# EAGLE design Arduino Board (EAGLE 9.5.2)
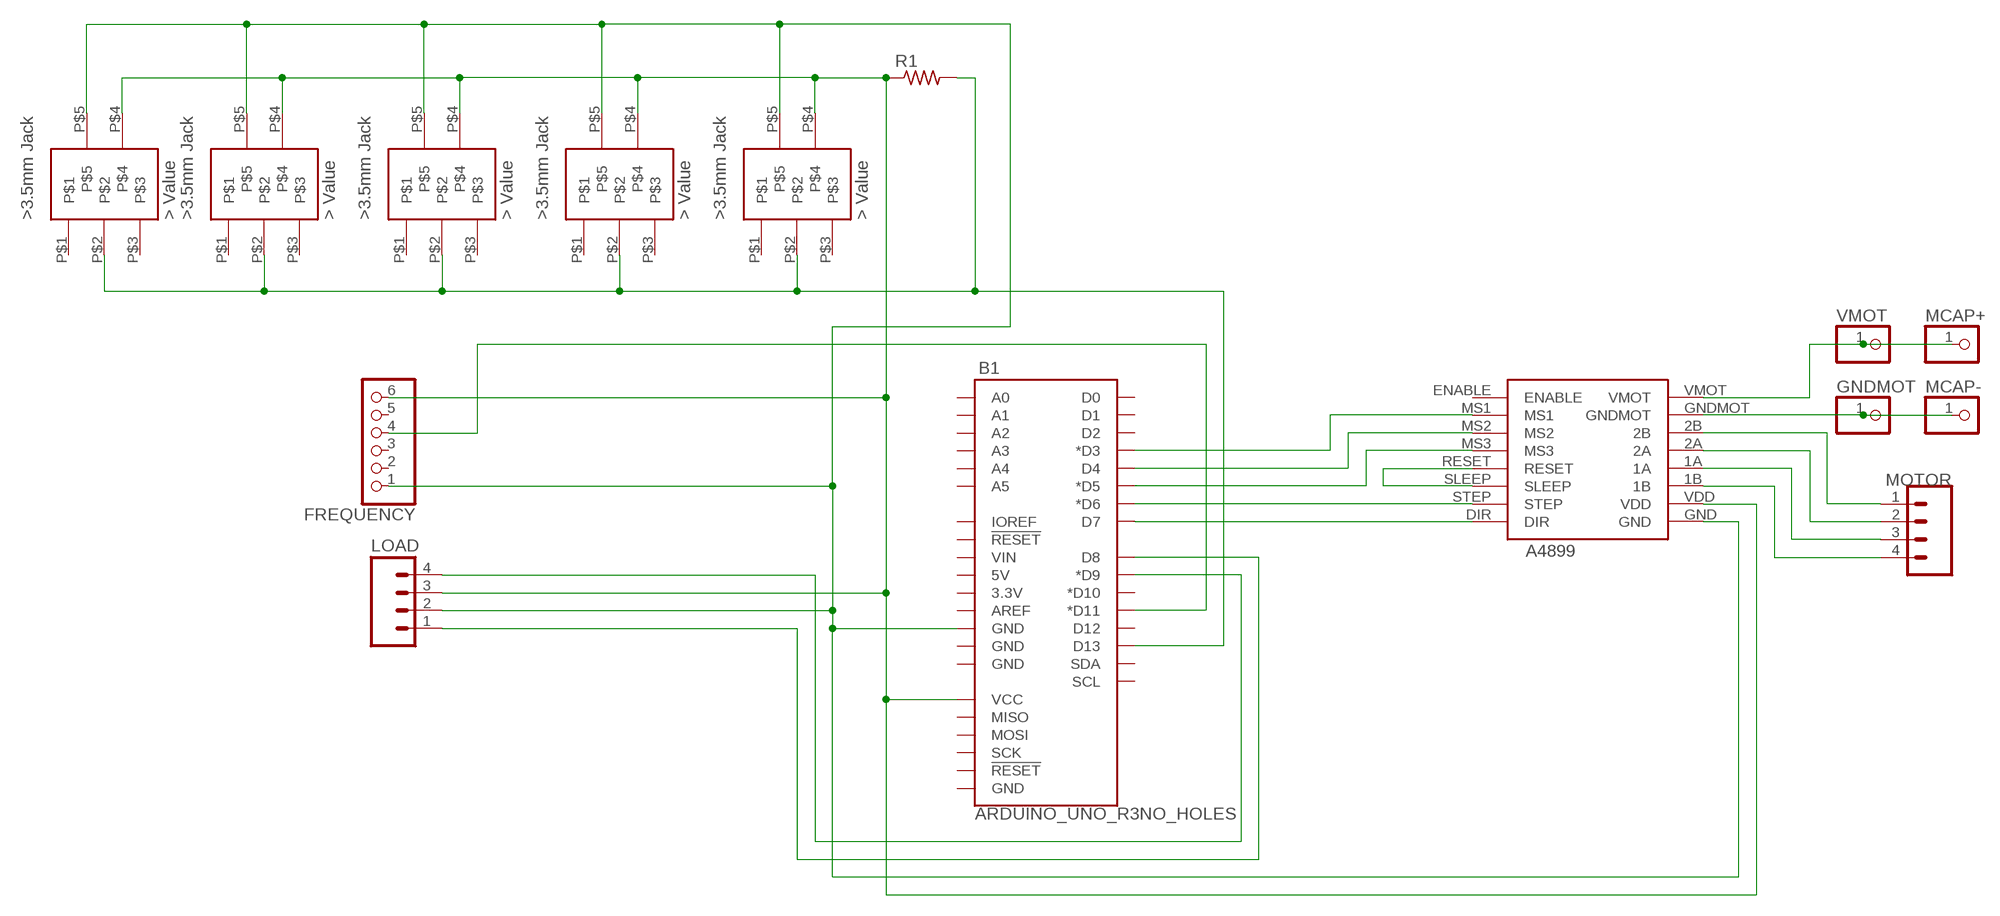
[diagram p0: schematic, sheet 1]

## Parts
3.5MM_JACK1  3.5MM_JACK  [3.5MM_JACK]
3.5MM_JACK2  3.5MM_JACK  [3.5MM_JACK]
3.5MM_JACK3  3.5MM_JACK  [3.5MM_JACK]
3.5MM_JACK4  3.5MM_JACK  [3.5MM_JACK]
3.5MM_JACK5  3.5MM_JACK  [3.5MM_JACK]
A4899_1  A4899  [A4899]
B1  ARDUINO_UNO_R3NO_HOLES  [ARDUINO_R3_NO_HOLES]
FREQUENCY  PINHD-1X6  [1X06]
GNDMOT  PINHD-1X1  [1X01]
LOAD  M04PTH  [1X04]
MCAP+  PINHD-1X1  [1X01]
MCAP-  PINHD-1X1  [1X01]
MOTOR  M04PTH  [1X04]
R1  R-US_0204/5  [0204/5]
VMOT  PINHD-1X1  [1X01]

## Nets
N$1: 3.5MM_JACK1.P$5 3.5MM_JACK2.P$5 3.5MM_JACK3.P$5 3.5MM_JACK4.P$5 3.5MM_JACK5.P$5 A4899_1.GND B1.GND@4(GND) FREQUENCY.1 LOAD.2
N$2: 3.5MM_JACK1.P$2 3.5MM_JACK2.P$2 3.5MM_JACK3.P$2 3.5MM_JACK4.P$2 3.5MM_JACK5.P$2 B1.D13 R1.2
N$3: A4899_1.1B MOTOR.4
N$4: B1.D11(*D11) FREQUENCY.4
N$5: B1.D9(*D9) LOAD.4
N$6: B1.D8 LOAD.1
N$7: A4899_1.VMOT MCAP+.1 VMOT.1
N$8: A4899_1.GNDMOT GNDMOT.1 MCAP-.1
N$9: A4899_1.2B MOTOR.1
N$10: A4899_1.2A MOTOR.2
N$11: A4899_1.1A MOTOR.3
N$12: A4899_1.MS3 B1.D5(*D5)
N$13: A4899_1.RESET A4899_1.SLEEP
N$14: 3.5MM_JACK1.P$4 3.5MM_JACK2.P$4 3.5MM_JACK3.P$4 3.5MM_JACK4.P$4 3.5MM_JACK5.P$4 A4899_1.VDD B1.VCC FREQUENCY.6 LOAD.3 R1.1
N$15: A4899_1.STEP B1.D6(*D6)
N$16: A4899_1.DIR B1.D7
N$17: A4899_1.MS2 B1.D4
N$18: A4899_1.MS1 B1.D3(*D3)
Unconnected: 3.5MM_JACK1.P$1 3.5MM_JACK1.P$3 3.5MM_JACK2.P$1 3.5MM_JACK2.P$3 3.5MM_JACK3.P$1 3.5MM_JACK3.P$3 3.5MM_JACK4.P$1 3.5MM_JACK4.P$3 3.5MM_JACK5.P$1 3.5MM_JACK5.P$3 A4899_1.ENABLE B1.3.3V B1.5V B1.A0 B1.A1 B1.A2 B1.A3 B1.A4 B1.A5 B1.AREF B1.D0 B1.D1 B1.D2 B1.D10(*D10) B1.D12 B1.GND@1(GND) B1.GND@2(GND) B1.GND@3(GND) B1.IOREF B1.MISO B1.MOSI B1.RESET@1(!RESET!) B1.RESET@2(!RESET!) B1.SCK B1.SCL B1.SDA B1.VIN FREQUENCY.2 FREQUENCY.3 FREQUENCY.5

## Library data of the parts
3.5MM_JACK1-3.5MM_JACK5 = 3.5mm_Jack:3.5MM_JACK
A4899_1 = A4899:A4899
B1 = SparkFun-Boards:ARDUINO_UNO_R3: Arduino R3 Footprint with SPI header Arduino Uno R3 Compatible Footprint. Matches PCB size of the original board. SparkFun Products: SAMD21 Dev Breakout <https://www.sparkfun.com/products/13672> RedBoard <https://www.sparkfun.com/products/12757> R3 Stackable Headers <https://www.sparkfun.com/products/11417>
FREQUENCY = adafruit:PINHD-1X6: PIN HEADER
GNDMOT MCAP+ MCAP- VMOT = adafruit:PINHD-1X1: Pin header 1x1 for 0.1" spacing With round pins
LOAD MOTOR = SparkFun-Connectors:M04: Header 4 Standard 4-pin 0.1" header. Use with straight break away headers (SKU : PRT-00116), right angle break away headers (PRT-00553), swiss pins (PRT-00743), machine pins (PRT-00117), and female headers (PRT-00115). Molex polarized connector foot print use with SKU : PRT-08231 with associated crimp pins and housings. 1MM SMD Version SKU: PRT-10208
R1 = BeagleBone_Black_Wireless:R-US_: RESISTOR, American symbol

## Board
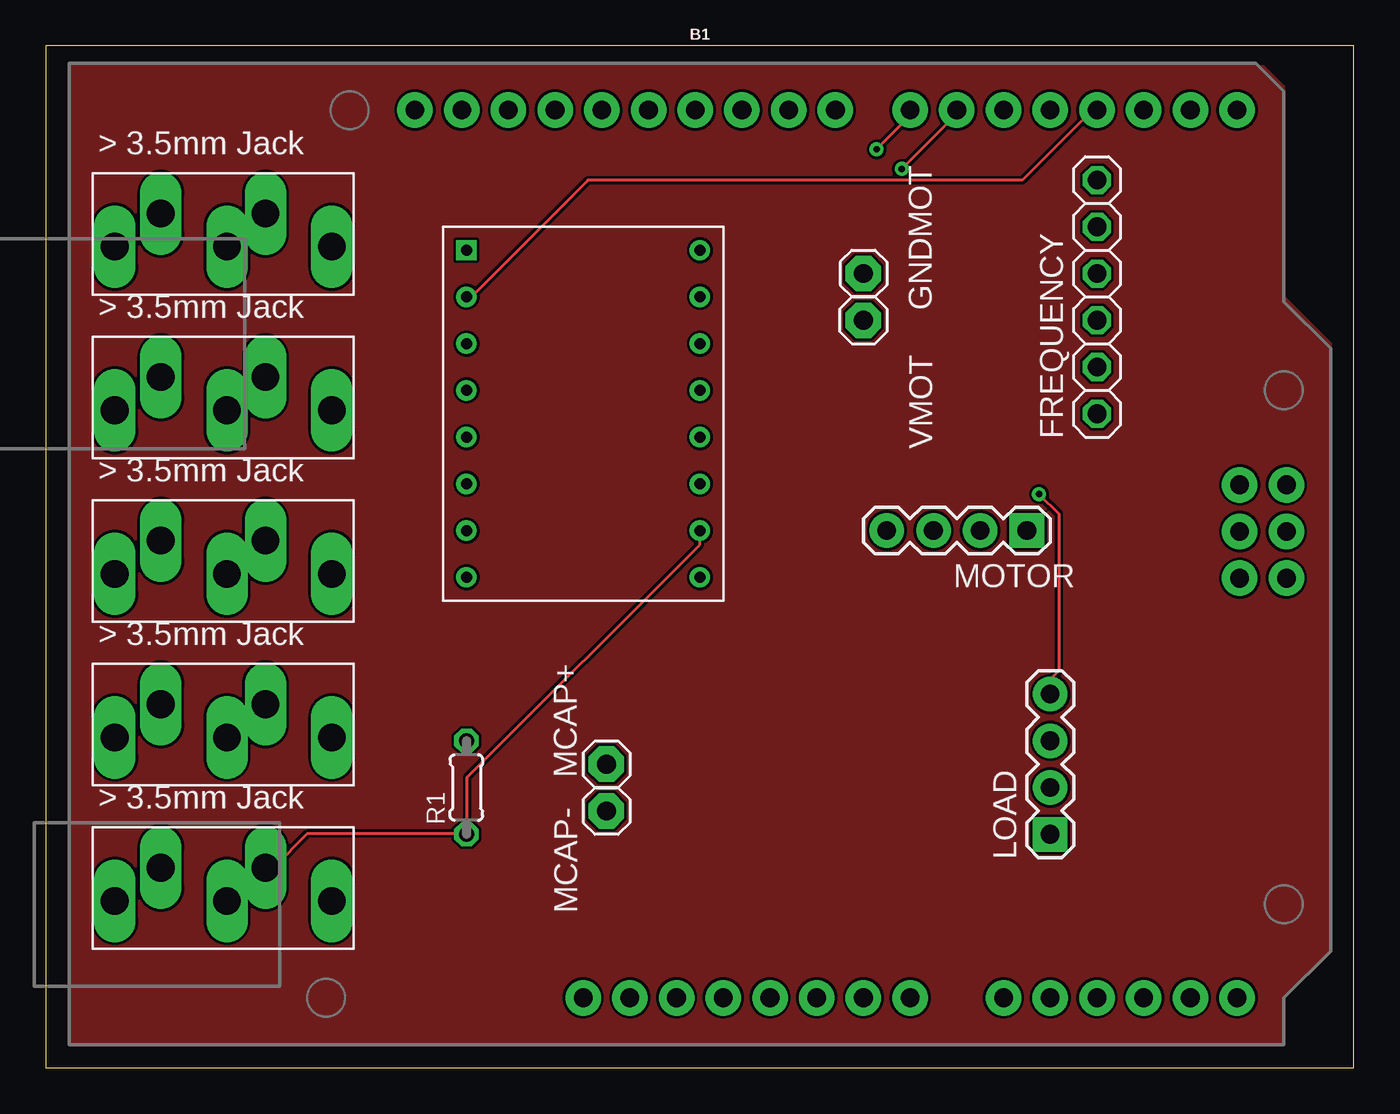
[diagram p1: board, top side]
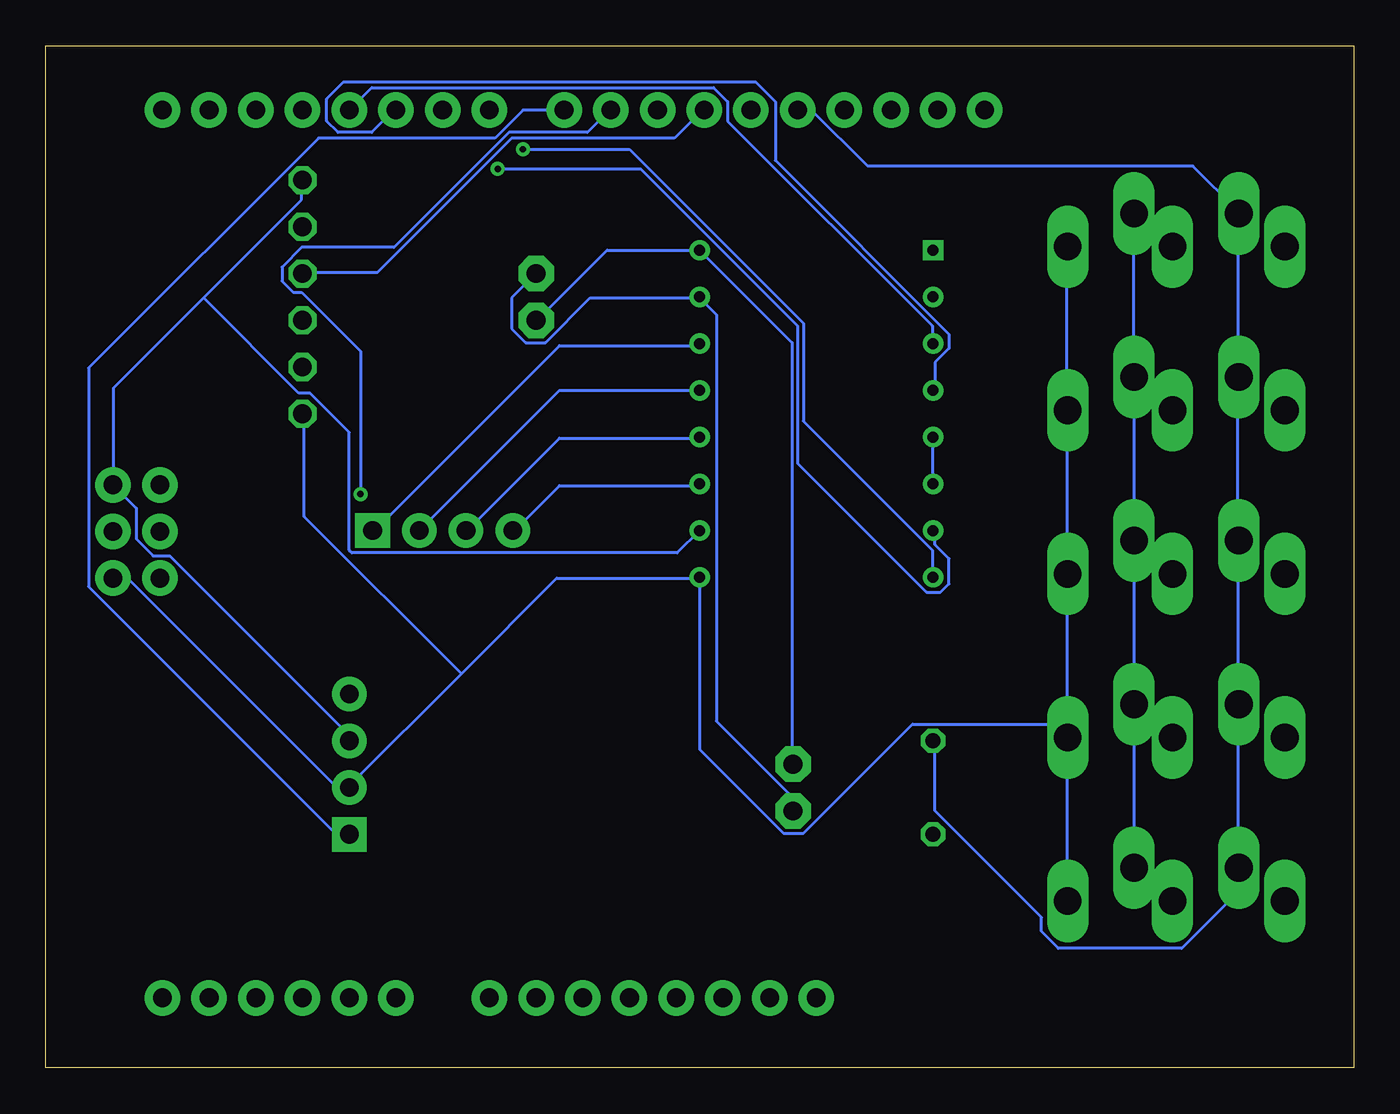
[diagram p2: board, bottom side, seen from below]

Size 71.1 x 55.55 mm. Coordinates in mm from the lower left corner, seen from the top.
Outline: 0,0 71.1,0 71.1,55.55 0,55.55 0,0
Copper layers (1*16): Top 0.035mm / dielectric 1.5mm / Bottom 0.035mm
Design rules "default": minimum track width 6mil, minimum drill 0.35mm, track to track 6mil, track to pad 6mil, pad to pad 6mil, via to via 6mil, smd to smd 6mil, copper to edge 40mil, drill to drill 6mil, minimum pad ring 10mil, minimum via ring 8mil, stop-mask expansion 4mil, vias tented up to drill 0mil, thermal gap 10mil

### Footprints (pad centres in the part's own frame; a part is rotated, then mirrored left to right if it is on the bottom)
3.5MM_JACK = drill 1.5 pad 1.676 long: P$1 1.2,4; P$2 3.7,5.8; P$3 7.3,4; P$4 9.4,5.8; P$5 13,4
A4899 = drill 0.6: 1A 13.97,8.89; 1B 13.97,6.35; 2A 13.97,11.43; 2B 13.97,13.97; DIR 1.27,1.27; GND 13.97,1.27; GNDMOT 13.97,16.51; MS1 1.27,16.51; MS2 1.27,13.97; MS3 1.27,11.43; RESET 1.27,8.89; SLEEP 1.27,6.35; STEP 1.27,3.81; VDD 13.97,3.81; VMOT 13.97,19.05 | drill 0.6 square: ENABLE 1.27,19.05
ARDUINO_R3_NO_HOLES = drill 1.016 pad 1.93: 3.3V 1.27,-24.13; 5V 3.81,-24.13; A0 16.51,-24.13; A1 19.05,-24.13; A2 21.59,-24.13; A3 24.13,-24.13; A4 26.67,-24.13; A5 29.21,-24.13; AREF -10.414,24.13; D0 29.21,24.13; D1 26.67,24.13; D2 24.13,24.13; D3 21.59,24.13; D4 19.05,24.13; D5 16.51,24.13; D6 13.97,24.13; D7 11.43,24.13; D8 7.366,24.13; D9 4.826,24.13; D10 2.286,24.13; D11 -0.254,24.13; D12 -2.794,24.13; D13 -5.334,24.13; GND@1 6.35,-24.13; GND@2 8.89,-24.13; GND@3 -7.874,24.13; GND@4 31.89,-1.32; IOREF -3.81,-24.13; MISO 29.35,3.76; MOSI 31.89,1.22; NC -6.35,-24.13; RESET@1 -1.27,-24.13; RESET@2 29.35,-1.32; SCK 29.35,1.22; SCL -15.494,24.13; SDA -12.954,24.13; VCC 31.89,3.76; VIN 11.43,-24.13
1X06 = drill 1.016 octagon: 1 -6.35,0; 2 -3.81,0; 3 -1.27,0; 4 1.27,0; 5 3.81,0; 6 6.35,0
1X01 = drill 1.016 pad 1.93 octagon: 1 0,0
1X04 = drill 1.016 pad 1.88 square: 1 0,0 | drill 1.016 pad 1.88: 2 2.54,0; 3 5.08,0; 4 7.62,0
0204/5 = drill 0.813 octagon: 1 -2.54,0; 2 2.54,0

### Placement (x,y rotation side)
3.5MM_JACK1  2.54,40.64 0 top
3.5MM_JACK2  2.54,31.75 0 top
3.5MM_JACK3  2.54,22.86 0 top
3.5MM_JACK4  2.54,13.97 0 top
3.5MM_JACK5  2.54,5.08 0 top
A4899_1  21.59,25.4 0 top
B1  35.56,27.94 0 top
FREQUENCY  57.15,41.91 90 top
GNDMOT  44.45,43.18 0 top
LOAD  54.61,12.7 90 top
MCAP+  30.48,16.51 0 top
MCAP-  30.48,13.97 0 top
MOTOR  53.34,29.21 180 top
R1  22.86,15.24 90 top
VMOT  44.45,40.64 90 top

### Tracks (layer width: path | path; a pad name or v marks a point on that pad's centre or on a via)
ARDUINO_BRD
  pour Top: 1.27,1.27 67.31,1.27 67.31,3.81 69.85,6.35 69.85,39.37 67.31,41.91 67.31,53.34 66.04,54.61 1.27,54.61
N$1
  Bottom 0.152: 3.5MM_JACK5.P$5 15.6,9.09 15.6,17.93 3.5MM_JACK4.P$5 | 3.5MM_JACK1.P$5 15.6,44.6 15.6,35.76 3.5MM_JACK2.P$5 15.6,35.61 15.6,26.92 3.5MM_JACK3.P$5 15.6,26.77 15.6,18.69 | 15.6,18.69 15.6,18.09 3.5MM_JACK4.P$5 | 35.56,26.62 43.33,26.62 48.51,21.44 | 54.61,15.34 48.51,21.44 | 48.51,21.44 57.05,29.97 57.05,35.46 FREQUENCY.1 | 54.61,15.34 55.37,15.34 66.65,26.62 67.41,26.62 B1.GND@4 | 54.61,15.34 LOAD.2 | 15.6,18.69 23.98,18.69 29.92,12.75 30.99,12.75 35.56,17.32 35.56,26.62 | 15.6,18.69 3.5MM_JACK4.P$5 | 35.56,26.62 A4899_1.GND
N$2
  Bottom 0.152: R1.2 22.76,17.78 22.76,13.97 16.97,8.18 16.97,7.42 16.05,6.5 9.35,6.5 6.3,9.55 6.3,10.77 3.5MM_JACK5.P$2 6.3,10.92 6.3,19.76 3.5MM_JACK4.P$2 6.3,19.91 6.3,28.6 3.5MM_JACK3.P$2 6.3,28.75 6.3,37.44 3.5MM_JACK2.P$2 6.3,37.59 6.3,46.43 3.5MM_JACK1.P$2 6.3,46.58 8.74,49.02 26.42,49.02 29.46,52.07 B1.D13
N$3
  Bottom 0.152: A4899_1.1B 35.56,31.65 43.18,31.65 45.62,29.21 MOTOR.4
N$4
  Bottom 0.152: FREQUENCY.4 57.05,43.23 53.09,43.23 45.77,50.55 36.93,50.55 35.41,52.07 B1.D11
N$5  (via drill 0.35)
  Top 0.152: LOAD.4 54.61,21.13 55.07,21.59 55.07,30.12 v54,31.19
  Bottom 0.152: v54,31.19 54,38.96 57.2,42.16 57.66,42.16 58.27,42.77 58.27,43.54 57.2,44.6 52.17,44.6 45.92,50.85 41.66,50.85 40.44,52.07 B1.D9
N$6
  Bottom 0.152: B1.D8 45.16,52.07 46.69,50.55 56.29,50.55 68.78,38.05 68.78,26.16 55.37,12.75 54.61,12.75 LOAD.1
N$7
  Bottom 0.152: VMOT.1 44.4,40.64 40.59,44.45 A4899_1.VMOT 30.53,39.42 30.53,16.56 MCAP+.1
N$8
  Bottom 0.152: 35.56,41.86 41.5,41.86 43.94,39.42 45.01,39.42 45.77,40.18 45.77,41.86 GNDMOT.1 | 35.56,41.86 34.65,40.95 34.65,18.85 30.53,14.73 30.53,13.97 MCAP-.1 | 35.56,41.86 A4899_1.GNDMOT
N$9
  Bottom 0.152: A4899_1.2B 35.56,39.27 43.18,39.27 53.24,29.21 MOTOR.1
N$10
  Bottom 0.152: A4899_1.2A 43.18,36.83 MOTOR.2
N$11
  Bottom 0.152: A4899_1.1A 35.56,34.24 43.18,34.24 48.21,29.21 MOTOR.3
N$12
  Bottom 0.152: A4899_1.MS3 22.76,36.83 22.76,38.35 22,39.12 22,39.88 31.45,49.33 31.45,52.53 32.51,53.59 54.92,53.59 55.83,52.68 55.83,51.46 55.22,50.85 53.39,50.85 52.17,52.07 B1.D5
N$13
  Bottom 0.152: A4899_1.SLEEP 22.91,31.8 22.91,34.24 A4899_1.RESET
N$14
  Top 0.152: A4899_1.VDD 35.56,28.45 22.91,15.8 22.91,12.75 R1.1 22.76,12.75 14.22,12.75 12.39,10.92 12.09,10.92 3.5MM_JACK5.P$4
  Bottom 0.152: 62.54,41.86 67.41,36.98 67.41,31.8 B1.VCC 67.41,31.65 66.19,30.43 66.19,28.75 65.28,27.84 64.36,27.84 54.61,18.09 LOAD.3 | 62.54,41.86 57.2,47.19 57.2,48.26 FREQUENCY.6 | 3.5MM_JACK5.P$4 11.94,10.92 3.5MM_JACK4.P$4 11.94,19.91 11.94,28.6 3.5MM_JACK3.P$4 11.94,28.75 11.94,37.44 3.5MM_JACK2.P$4 11.94,37.59 3.5MM_JACK1.P$4 | 62.54,41.86 57.35,36.68 56.74,36.68 54.61,34.54 54.61,28.14 54.46,27.99 36.78,27.99 A4899_1.VDD
N$15  (via drill 0.35)
  Top 0.152: v46.53,48.87 49.43,51.76 49.43,52.07 B1.D6
  Bottom 0.152: v46.53,48.87 38.76,48.87 30.23,40.33 30.23,32.87 23.22,25.86 22.45,25.86 22,26.31 22,27.69 22.76,28.45 22.76,29.21 A4899_1.STEP
N$16  (via drill 0.35)
  Top 0.152: v45.16,49.94 46.99,51.76 B1.D7
  Bottom 0.152: v45.16,49.94 39.37,49.94 29.92,40.49 29.92,35.15 22.91,28.14 22.91,26.77 A4899_1.DIR
N$17
  Bottom 0.152: B1.D4 53.39,53.29 34.8,53.29 34.04,52.53 34.04,51.46 22.91,40.33 22.91,39.42 A4899_1.MS2
N$18
  Top 0.152: B1.D3 56.9,52.07 53.09,48.26 29.46,48.26 23.22,42.01 22.91,42.01 A4899_1.MS1